# EAGLE design AM1027 LEDS REV01 (EAGLE 6.6.0)
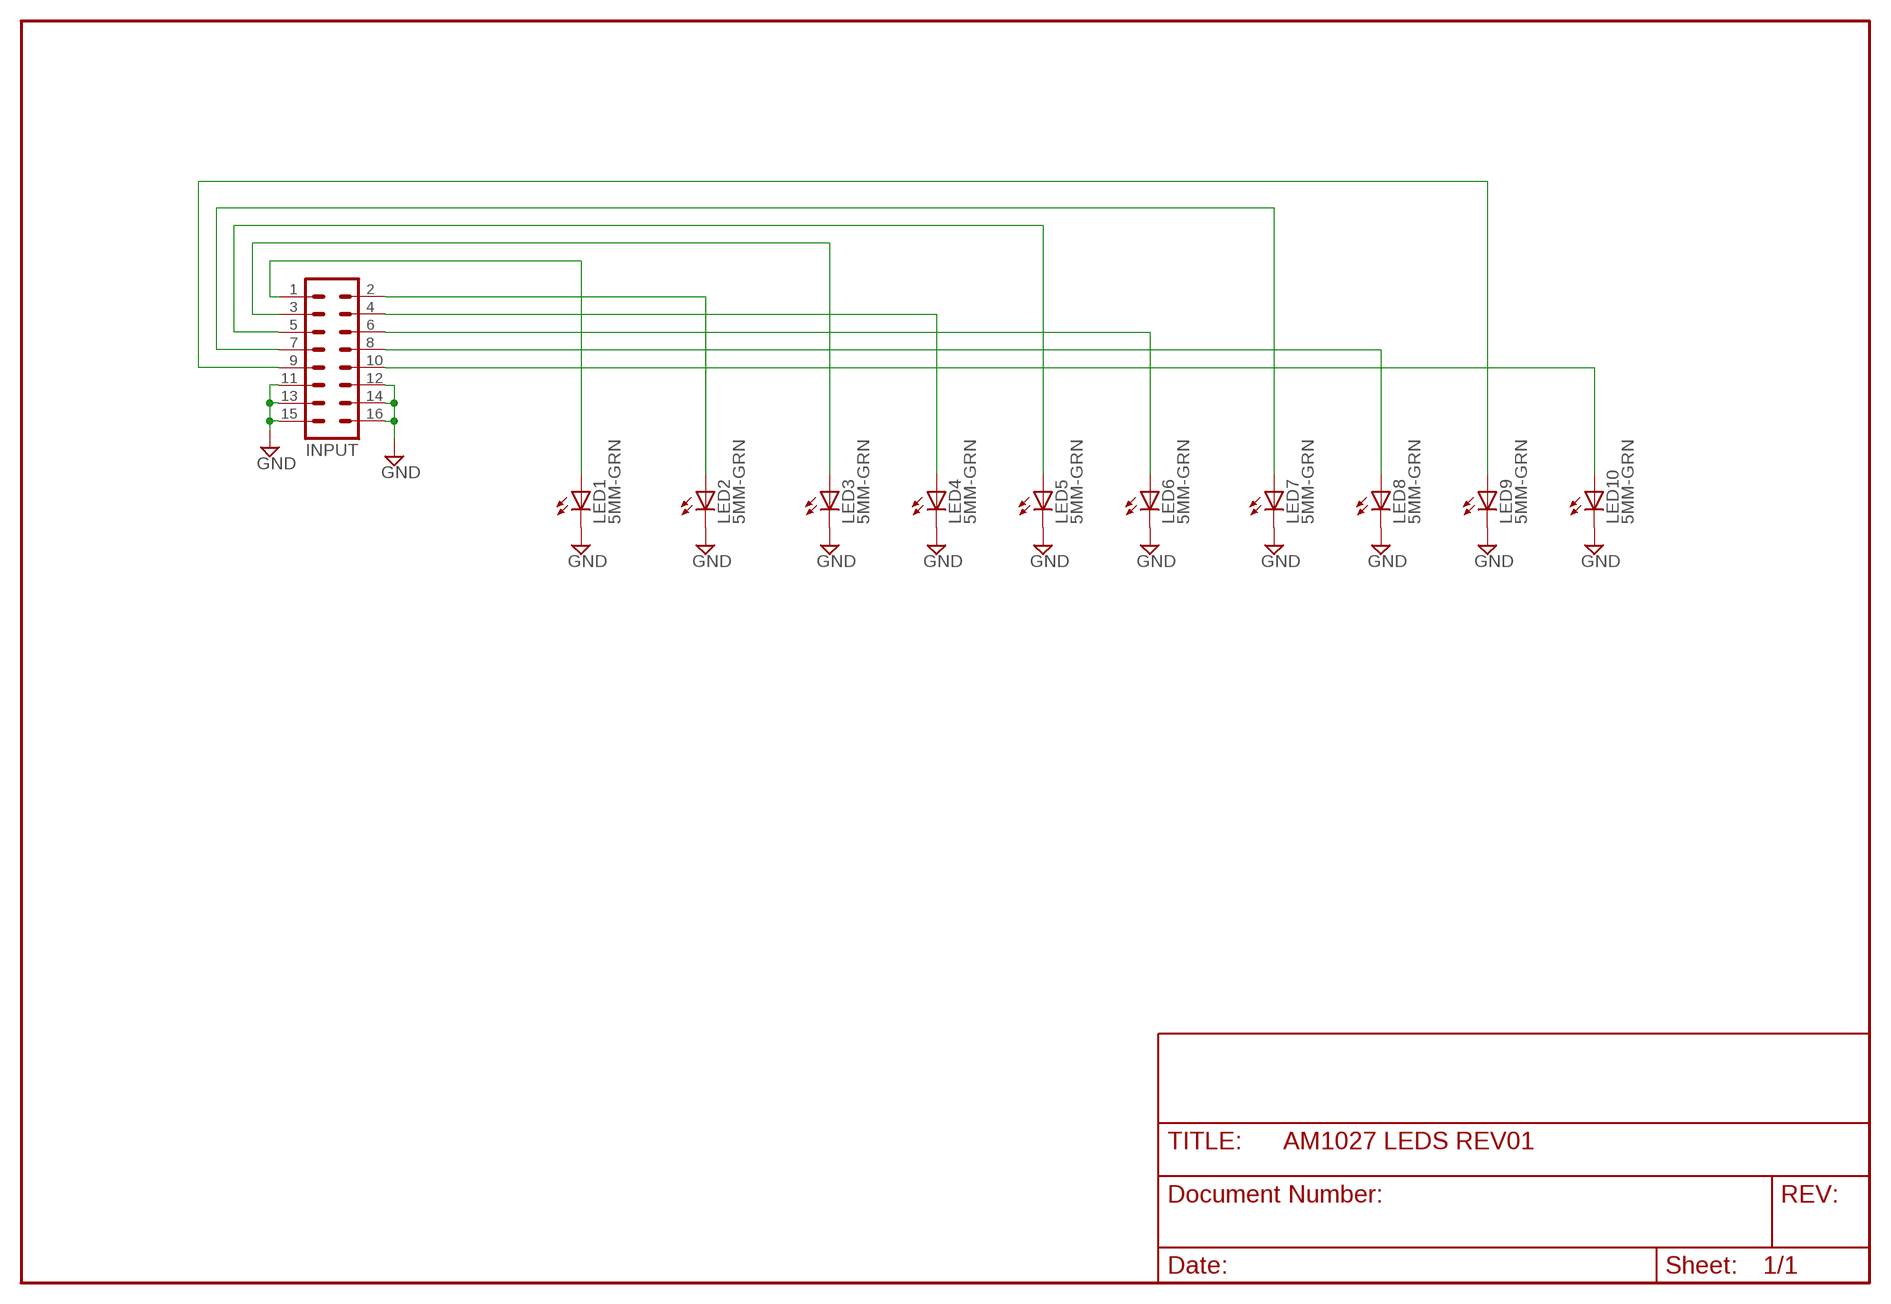
[diagram p0: schematic, sheet 1]

## Parts
INPUT  MA08-2-AM  [MA08-2-AM]
LED1  5MM-GRN  LED3MM-AM  [LED3MM-AMS]
LED2  5MM-GRN  LED3MM-AM  [LED3MM-AMS]
LED3  5MM-GRN  LED3MM-AM  [LED3MM-AMS]
LED4  5MM-GRN  LED3MM-AM  [LED3MM-AMS]
LED5  5MM-GRN  LED3MM-AM  [LED3MM-AMS]
LED6  5MM-GRN  LED3MM-AM  [LED3MM-AMS]
LED7  5MM-GRN  LED3MM-AM  [LED3MM-AMS]
LED8  5MM-GRN  LED3MM-AM  [LED3MM-AMS]
LED9  5MM-GRN  LED3MM-AM  [LED3MM-AMS]
LED10  5MM-GRN  LED3MM-AM  [LED3MM-AMS]

## Nets
GND [POWER]: INPUT.11 INPUT.12 INPUT.13 INPUT.14 INPUT.15 INPUT.16 LED1.C LED2.C LED3.C LED4.C LED5.C LED6.C LED7.C LED8.C LED9.C LED10.C
N$2: INPUT.2 LED2.A
N$11: INPUT.1 LED1.A
N$12: INPUT.3 LED3.A
N$14: INPUT.4 LED4.A
N$15: INPUT.5 LED5.A
N$16: INPUT.6 LED6.A
N$17: INPUT.7 LED7.A
N$18: INPUT.8 LED8.A
N$19: INPUT.9 LED9.A
N$20: INPUT.10 LED10.A

## Library data of the parts
INPUT = con-lstb:MA08-2-AM
LED1-LED10 = led:LED3MM-AM: LED 3MM - AM style

## Net classes
0 default: width 0.254 mm, drill 0.7 mm, clearance 0.254 mm
1 POWER: width 0.635 mm, drill 0.7 mm, clearance 0.635 mm

## Board
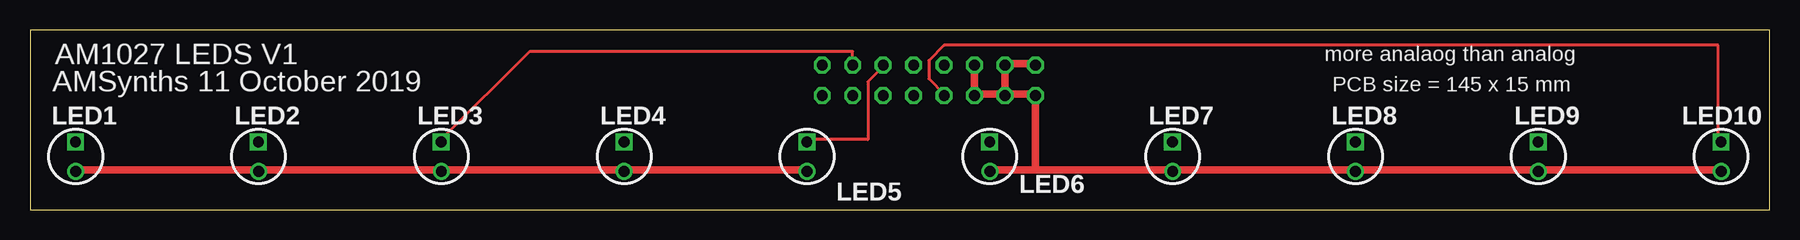
[diagram p1: board, top side]
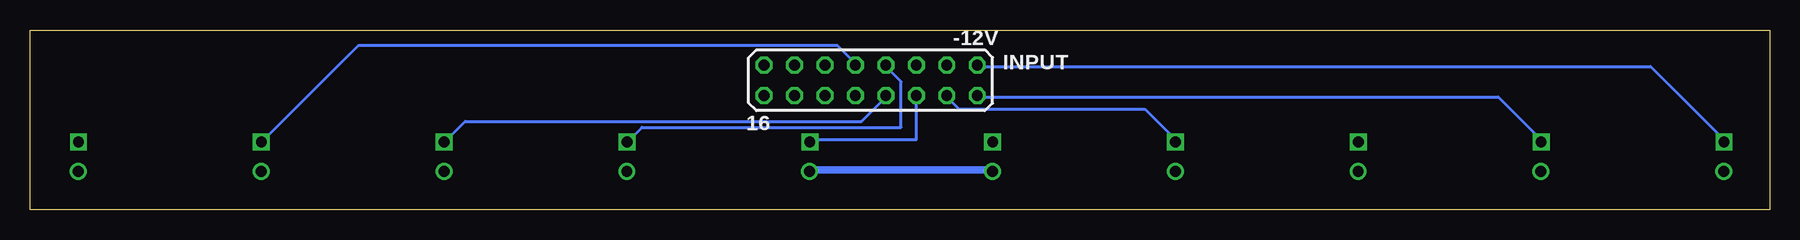
[diagram p2: board, bottom side, seen from below]

Size 145 x 15 mm. Coordinates in mm from the lower left corner, seen from the top.
Outline: 0,0 145,0 145,15 0,15 0,0
Copper layers (1*16): Top 0.035mm / dielectric 1.5mm / Bottom 0.035mm
Design rules "default": minimum track width 10mil, minimum drill 24mil, track to track 8mil, track to pad 8mil, pad to pad 8mil, via to via 8mil, smd to smd 8mil, copper to edge 40mil, drill to drill 8mil, minimum pad ring 10mil, minimum via ring 8mil, stop-mask expansion 4mil, vias tented up to drill 0mil, thermal gap 10mil

### Footprints (pad centres in the part's own frame; a part is rotated, then mirrored left to right if it is on the bottom)
MA08-2-AM = drill 0.9 octagon: 1 -8.89,-1.27; 2 -8.89,1.27; 3 -6.35,-1.27; 4 -6.35,1.27; 5 -3.81,-1.27; 6 -3.81,1.27; 7 -1.27,-1.27; 8 -1.27,1.27; 9 1.27,-1.27; 10 1.27,1.27; 11 3.81,-1.27; 12 3.81,1.27; 13 6.35,-1.27; 14 6.35,1.27; 15 8.89,-1.27; 16 8.89,1.27
LED3MM-AMS = drill 0.9 square: A -1.203,-0.015 | drill 0.9: C 1.254,0

### Placement (x,y rotation side)
INPUT  74.93,10.79 180 bottom
LED1  3.81,4.45 270 top
LED2  19.05,4.45 270 top
LED3  34.29,4.45 270 top
LED4  49.53,4.45 270 top
LED5  64.77,4.45 270 top
LED6  80.01,4.45 270 top
LED7  95.25,4.45 270 top
LED8  110.49,4.45 270 top
LED9  125.73,4.45 270 top
LED10  140.97,4.45 270 top

### Tracks (layer width: path | path; a pad name or v marks a point on that pad's centre or on a via)
GND
  Top 0.635: LED1.C 3.81,3.3 19.05,3.3 LED2.C 19.3,3.3 34.29,3.3 LED3.C 34.54,3.3 49.53,3.3 LED4.C 49.78,3.3 64.77,3.3 LED5.C | INPUT.11 INPUT.12 78.99,9.65 81.28,9.65 INPUT.14 | INPUT.14 INPUT.13 81.53,12.19 83.82,12.19 INPUT.15 | 83.82,3.3 80.01,3.3 LED6.C | 83.82,3.3 INPUT.16 83.57,9.65 81.53,9.65 INPUT.14 | 83.82,3.3 95.25,3.3 LED7.C 95.5,3.3 110.49,3.3 LED8.C 110.74,3.3 125.73,3.3 LED9.C 125.98,3.3 140.97,3.3 LED10.C
  Bottom 0.635: LED5.C 64.77,3.3 80.01,3.3 LED6.C
N$2
  Bottom 0.254: LED2.A 19.05,5.84 22.61,9.4 66.04,9.4 INPUT.2
N$11
  Bottom 0.254: LED1.A 3.81,5.84 9.91,11.94 66.04,11.94 INPUT.1
N$12
  Top 0.254: INPUT.3 68.58,13.21 41.66,13.21 34.29,5.84 LED3.A
N$14
  Bottom 0.254: LED4.A 49.53,5.84 52.07,8.38 67.56,8.38 68.58,9.4 INPUT.4
N$15
  Top 0.254: LED5.A 64.77,5.84 69.85,5.84 69.85,10.67 71.12,11.94 INPUT.5
N$16
  Bottom 0.254: INPUT.6 71.12,5.84 79.76,5.84 LED6.A
N$17
  Bottom 0.254: INPUT.7 73.66,11.94 72.39,10.67 72.39,6.86 93.98,6.86 95,5.84 LED7.A
N$18
  Bottom 0.254: INPUT.8 73.66,9.4 75.69,7.37 108.71,7.37 110.24,5.84 LED8.A
N$19
  Bottom 0.254: INPUT.9 76.2,12.19 77.72,13.72 117.6,13.72 125.48,5.84 LED9.A
N$20
  Top 0.254: INPUT.10 76.2,9.65 74.93,10.92 74.93,12.45 76.2,13.72 140.72,13.72 140.72,5.84 LED10.A

### Text on the board
tNames: AM1027 LEDS V1 | more analaog than analog | AMSynths 11 October 2019 | PCB size = 145 x 15 mm